# EAGLE schematic usbisp_3V3 (EAGLE 5.06)
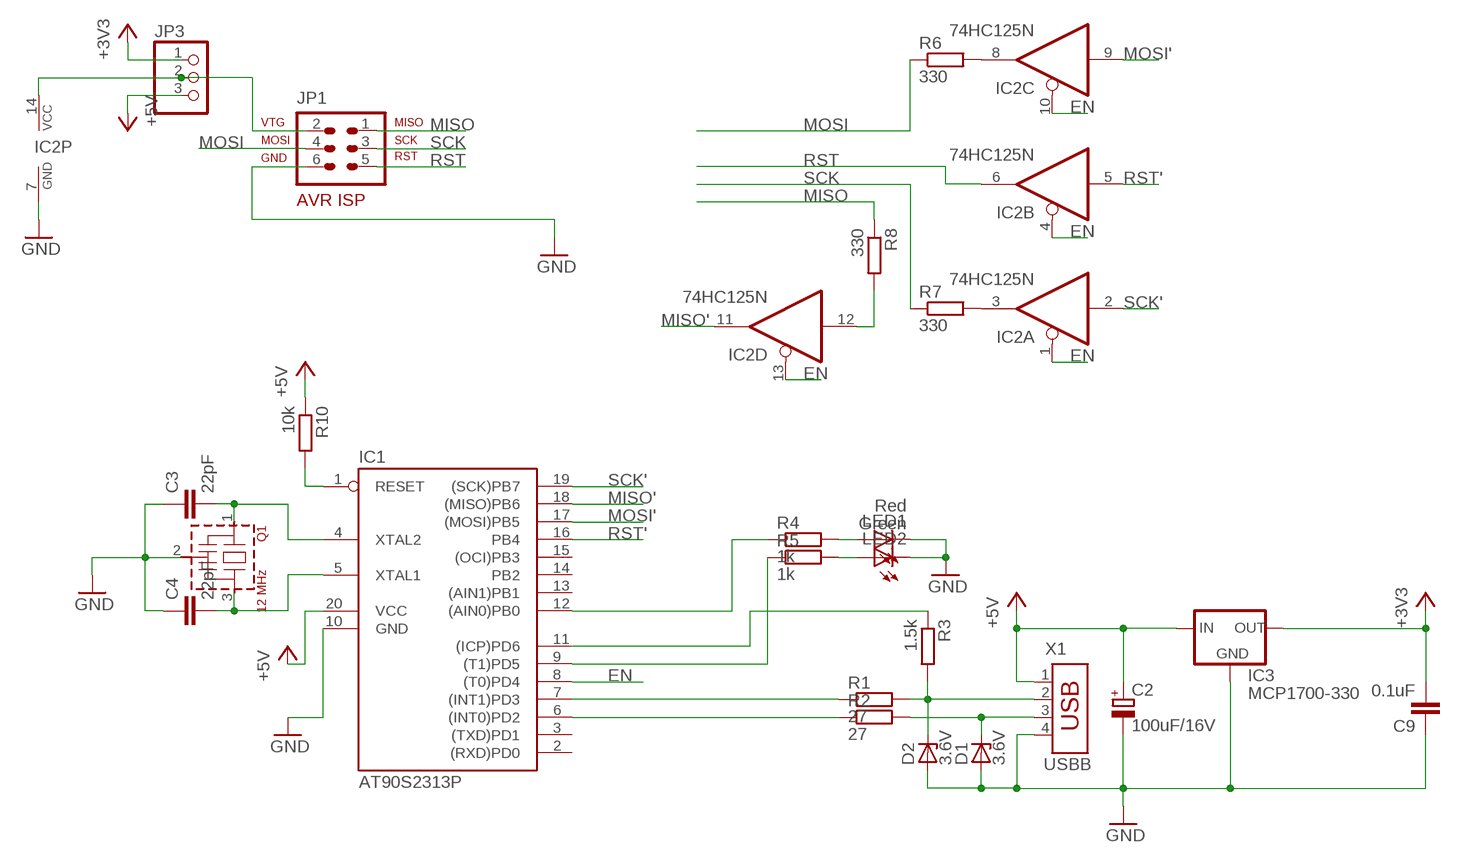
[diagram p0: schematic, sheet 1]

## Parts
C2  100uF/16V  CPOL-EUE2.5-6  [E2,5-6]
C3  22pF  C-EU025-025X050  [C025-025X050]
C4  22pF  C-EU025-025X050  [C025-025X050]
C9  0.1uF  C-EU025-025X050  [C025-025X050]
D1  3.6V  1N4728  [DO41Z10]
D2  3.6V  1N4728  [DO41Z10]
IC1  AT90S2313P  [DIL20]
IC2  74HC125N  [DIL14]
IC3  MCP1700-330  [MCP1700-330]
JP1  AVR-ISP-6  [AVR-ISP-6]
JP3  PINHD-1X3  [1X03]
LED1  Red  LED3MM  [LED3MM]
LED2  Green  LED3MM  [LED3MM]
Q1  12 MHz  CSTLS_G*  [CSTLS_G9]
R1  27  R-EU_0207/7  [0207/7]
R2  27  R-EU_0207/7  [0207/7]
R3  1.5k  R-EU_0207/7  [0207/7]
R4  1k  R-EU_0207/7  [0207/7]
R5  1k  R-EU_0207/7  [0207/7]
R6  330  R-EU_0207/7  [0207/7]
R7  330  R-EU_0207/7  [0207/7]
R8  330  R-EU_0207/7  [0207/7]
R10  10k  R-EU_0207/7  [0207/7]
X1  USBB  [USB-B]

## Nets
+3V3: C9.2 IC3.OUT JP3.1
+5V: C2.+ IC1.20(VCC) IC3.IN JP3.3 R10.1 X1.1
EN: IC1.8((T0)PD4) IC2.1(A:OE) IC2.4(B:OE) IC2.10(C:OE) IC2.13(D:OE)
GND: C2.- C3.1 C4.1 C9.1 D1.A D2.A IC1.10(GND) IC2.7(P:GND) IC3.GND JP1.6(GND) LED1.K(C) LED2.K(C) Q1.2(VSS) X1.4
MISO: JP1.1(MISO) R8.1
MISO': IC1.18((MISO)PB6) IC2.11(D:O)
MOSI: JP1.4(MOSI) R6.1
MOSI': IC1.17((MOSI)PB5) IC2.9(C:I)
N$1: C3.2 IC1.4(XTAL2) Q1.1
N$2: C4.2 IC1.5(XTAL1) Q1.3
N$3: IC1.6((INT0)PD2) R2.1
N$4: IC1.7((INT1)PD3) R1.1
N$5: D1.C R2.2 X1.3
N$6: D2.C R1.2 R3.2 X1.2
N$7: IC1.11((ICP)PD6) R3.1
N$8: IC1.9((T1)PD5) R5.1
N$9: IC1.12((AIN0)PB0) R4.1
N$10: LED2.A R5.2
N$11: LED1.A R4.2
N$12: IC1.1(RESET) R10.2
N$13: IC2.14(P:VCC) JP1.2(VTG) JP3.2
N$15: IC2.12(D:I) R8.2
N$16: IC2.3(A:O) R7.2
N$17: IC2.8(C:O) R6.2
RST: IC2.6(B:O) JP1.5(RST)
RST': IC1.16(PB4) IC2.5(B:I)
SCK: JP1.3(SCK) R7.1
SCK': IC1.19((SCK)PB7) IC2.2(A:I)
Unconnected: IC1.2((RXD)PD0) IC1.3((TXD)PD1) IC1.13((AIN1)PB1) IC1.14(PB2) IC1.15((OCI)PB3) X1.S1(G1) X1.S2(G2)

## Library data of the parts
C2 = USBISP:CPOL-EU: POLARIZED CAPACITOR, European symbol
C3 C4 C9 = USBISP:C-EU: CAPACITOR, European symbol
D1 D2 = USBISP:1N4728: Z DIODE 3.3 V, 1W, 5 percent
IC1 = USBISP:AT90S2313: MICROCONTROLLER 2 Kbytes FLASH 128 bytes SRAM 128 bytes EEPROM UART
IC2 = USBISP:74*125: Quad bus BUFFER, 3-state
IC3 = USBISP:MCP1700-330: VOLTAGE REGULATOR
JP1 = USBISP:AVR-ISP-6: AVR ISP-6 Serial Programming Header
JP3 = USBISP:PINHD-1X3: PIN HEADER
LED1 LED2 = USBISP:LED: LED OSRAM: - CHIPLED LG R971, LG N971, LY N971, LG Q971, LY Q971, LO R971, LY R971 LH N974, LH R974 LS Q976, LO Q976, LY Q976 LO Q996 - Hyper CHIPLED LW Q18S LB Q993, LB Q99A, LB R99A - SideLED LS A670, LO A670, LY A670, LG A670, LP A670 LB A673, LV A673, LT A673, LW A673 LH A674 LY A675 LS A676, LA A676, LO A676, LY A676, LW A676 LS A679, LY A679, LG A679 - Hyper Micro SIDELED® LS Y876, LA Y876, LO Y876, LY Y876 LT Y87S - SmartLED LW L88C, LW L88S LB L89C, LB L89S, LG L890 LS L89K, LO L89K, LY L89K LS L896, LA L896, LO L896, LY L896 - TOPLED LS T670, LO T670, LY T670, LG T670, LP T670 LSG T670, LSP T670, LSY T670, LOP T670, LYG T670 LG T671, LOG T671, LSG T671 LB T673, LV T673, LT T673, LW T673 LH T674 LS T676, LA T676, LO T676, LY T676, LB T676, LH T676, LSB T676, LW T676 LB T67C, LV T67C, LT T67C, LS T67K, LO T67K, LY T67K, LW E67C LS E67B, LA E67B, LO E67B, LY E67B, LB E67C, LV E67C, LT E67C LW T67C LS T679, LY T679, LG T679 LS T770, LO T770, LY T770, LG T770, LP T770 LB T773, LV T773, LT T773, LW T773 LH T774 LS E675, LA E675, LY E675, LS T675 LS T776, LA T776, LO T776, LY T776, LB T776 LHGB T686 LT T68C, LB T68C - Hyper Mini TOPLED® LB M676 - Mini TOPLED Santana® LG M470 LS M47K, LO M47K, LY M47K Source: http://www.osram.convergy.de - LUMILED® LXK2-PW12-R00, LXK2-PW12-S00, LXK2-PW14-U00, LXK2-PW14-V00 LXK2-PM12-R00, LXK2-PM12-S00, LXK2-PM14-U00 LXK2-PE12-Q00, LXK2-PE12-R00, LXK2-PE12-S00, LXK2-PE14-T00, LXK2-PE14-U00 LXK2-PB12-K00, LXK2-PB12-L00, LXK2-PB12-M00, LXK2-PB14-N00, LXK2-PB14-P00, LXK2-PB14-Q00 LXK2-PR12-L00, LXK2-PR12-M00, LXK2-PR14-Q00, LXK2-PR14-R00 LXK2-PD12-Q00, LXK2-PD12-R00, LXK2-PD12-S00 LXK2-PH12-R00, LXK2-PH12-S00 LXK2-PL12-P00, LXK2-PL12-Q00, LXK2-PL12-R00 Source: www.luxeon.com
Q1 = USBISP:CSTLS_G: Ceramic resonator 2.00 to 10.00 MHz
R1-R8 R10 = USBISP:R-EU_: RESISTOR, European symbol
X1 = USBISP:USB